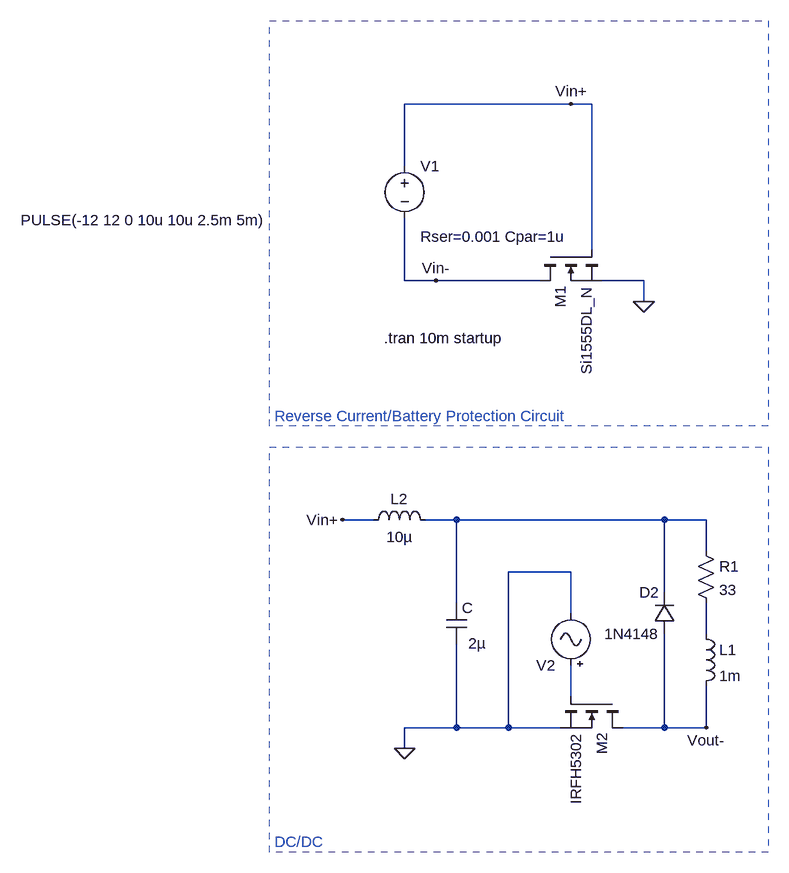
[diagram p0: schematic Reverse Current Battery Protection.asc]
Reverse Current Battery Protection.asc, the LTspice schematic file:
Version 4
SHEET 1 1352 1172
WIRE 208 16 -48 16
WIRE 240 16 208 16
WIRE -48 112 -48 16
WIRE 240 240 240 16
WIRE -48 288 -48 192
WIRE 0 288 -48 288
WIRE 160 288 0 288
WIRE 320 288 256 288
WIRE 320 320 320 288
WIRE -96 656 -144 656
WIRE 32 656 -16 656
WIRE 352 656 32 656
WIRE 416 656 352 656
WIRE 416 704 416 656
WIRE 208 736 112 736
WIRE 352 768 352 656
WIRE 32 784 32 656
WIRE 208 800 208 736
WIRE 416 832 416 784
WIRE 208 928 208 880
WIRE 32 976 32 848
WIRE 32 976 -48 976
WIRE 112 976 112 736
WIRE 112 976 32 976
WIRE 192 976 112 976
WIRE 352 976 352 832
WIRE 352 976 288 976
WIRE 416 976 416 912
WIRE 416 976 352 976
WIRE -48 1008 -48 976
FLAG 320 320 0
FLAG 208 16 Vin+
FLAG 416 976 Vout-
FLAG -144 656 Vin+
FLAG 0 288 Vin-
FLAG -48 1008 0
SYMBOL voltage -48 96 R0
WINDOW 123 0 0 Left 0
WINDOW 39 24 124 Left 2
WINDOW 3 -591 99 Left 2
SYMATTR SpiceLine Rser=0.001 Cpar=1u
SYMATTR Value PULSE(-12 12 0 10u 10u 2.5m 5m)
SYMATTR InstName V1
SYMBOL nmos 160 240 M90
SYMATTR InstName M1
SYMATTR Value Si1555DL_N
SYMBOL nmos 288 928 R90
SYMATTR InstName M2
SYMATTR Value IRFH5302
SYMBOL res 400 688 R0
SYMATTR InstName R1
SYMATTR Value 33
SYMBOL Misc\\signal 208 896 R180
WINDOW 123 0 0 Left 0
WINDOW 3 -141 -4 Invisible 2
SYMATTR Value PULSE(0 3.3 0 0 0 0.05m 0.1m)
SYMATTR SpiceLine Rser=1k
SYMATTR InstName V2
SYMBOL ind 400 816 R0
SYMATTR InstName L1
SYMATTR Value 1m
SYMBOL diode 368 832 R180
WINDOW 0 24 64 Left 2
WINDOW 3 24 0 Left 2
SYMATTR InstName D2
SYMATTR Value 1N4148
SYMBOL ind -112 672 R270
WINDOW 0 32 56 VTop 2
WINDOW 3 5 56 VBottom 2
SYMATTR InstName L2
SYMATTR Value 10µ
SYMBOL cap 16 784 R0
WINDOW 3 34 62 Left 2
SYMATTR Value 2µ
SYMATTR InstName C
TEXT -80 376 Left 2 !.tran 10m startup
TEXT -248 496 Left 2 ;Reverse Current/Battery Protection Circuit
TEXT -248 1152 Left 2 ;DC/DC
RECTANGLE Normal 512 512 -256 -112 2
RECTANGLE Normal 512 1168 -256 544 2

The netlist it stands for:
* Reverse Current Battery Protection.asc
V1 Vin+ Vin- PULSE(-12 12 0 10u 10u 2.5m 5m) Rser=0.001 Cpar=1u
M1 Vin- Vin+ 0 0 Si1555DL_N
M2 Vout- N003 0 0 IRFH5302
R1 N001 N002 33
V2 N003 0 PULSE(0 3.3 0 0 0 0.05m 0.1m) Rser=1k
L1 N002 Vout- 1m
D2 Vout- N001 1N4148
L2 Vin+ N001 10µ
C N001 0 2µ
.model D D
.lib standard.dio
.model NMOS NMOS
.model PMOS PMOS
.lib standard.mos
.tran 10m startup
* Reverse Current/Battery Protection Circuit
* DC/DC
.backanno
.end